# EAGLE schematic FA-32BR_Cable (EAGLE 7.2.0)
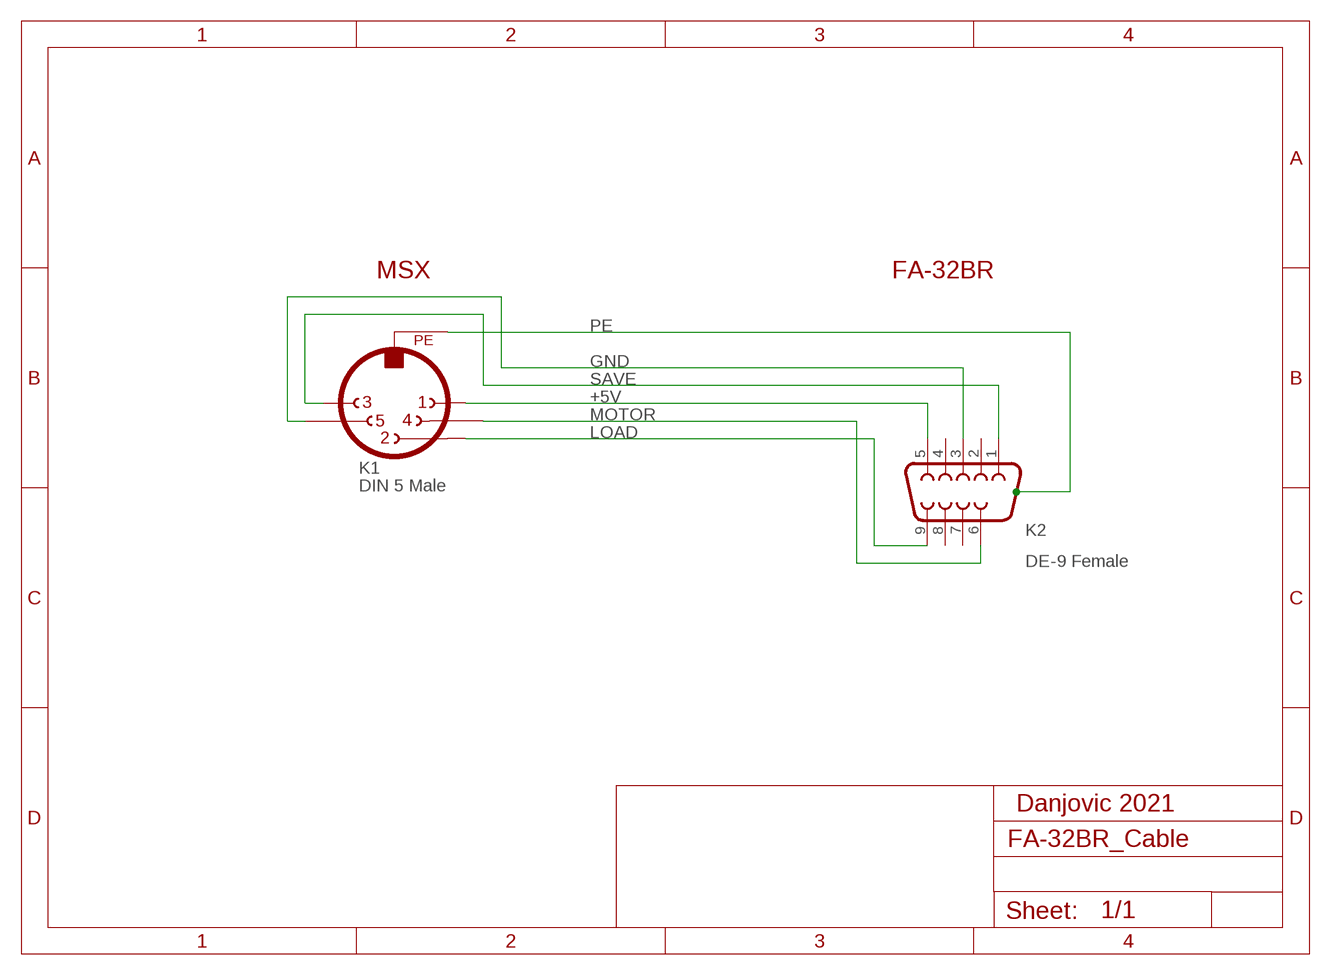
[diagram p0: schematic, sheet 1]

## Parts
K1  DIN 5 Male  MAB5SV  [MAB5SV]
K2  DE-9 Female  F09D  [F09D]

## Nets
+5V: K1.1 K2.5
GND: K1.5 K2.3
LOAD: K1.2 K2.9
MOTOR: K1.4 K2.6
PE: K1.PE
SAVE: K1.3 K2.1
Unconnected: K2.2 K2.4 K2.7 K2.8

## Notes on the sheet
- MSX | FA-32BR
- Danjovic 2021

## Library data of the parts
K1 = con-hirschmann:MAB5SV: Female CONNECTOR 5 pins 90 deg. with shield, vertical (DIN41524); OC_FARNELL: unknown; OC_NEWARK: unknown
K2 = con-subd:F09: SUB-D; OC_FARNELL: unknown; OC_NEWARK: unknown